# Altium schematic sheet RFID PIC.SchDoc
size A; SheetNumber: 1; SheetTotal: 1
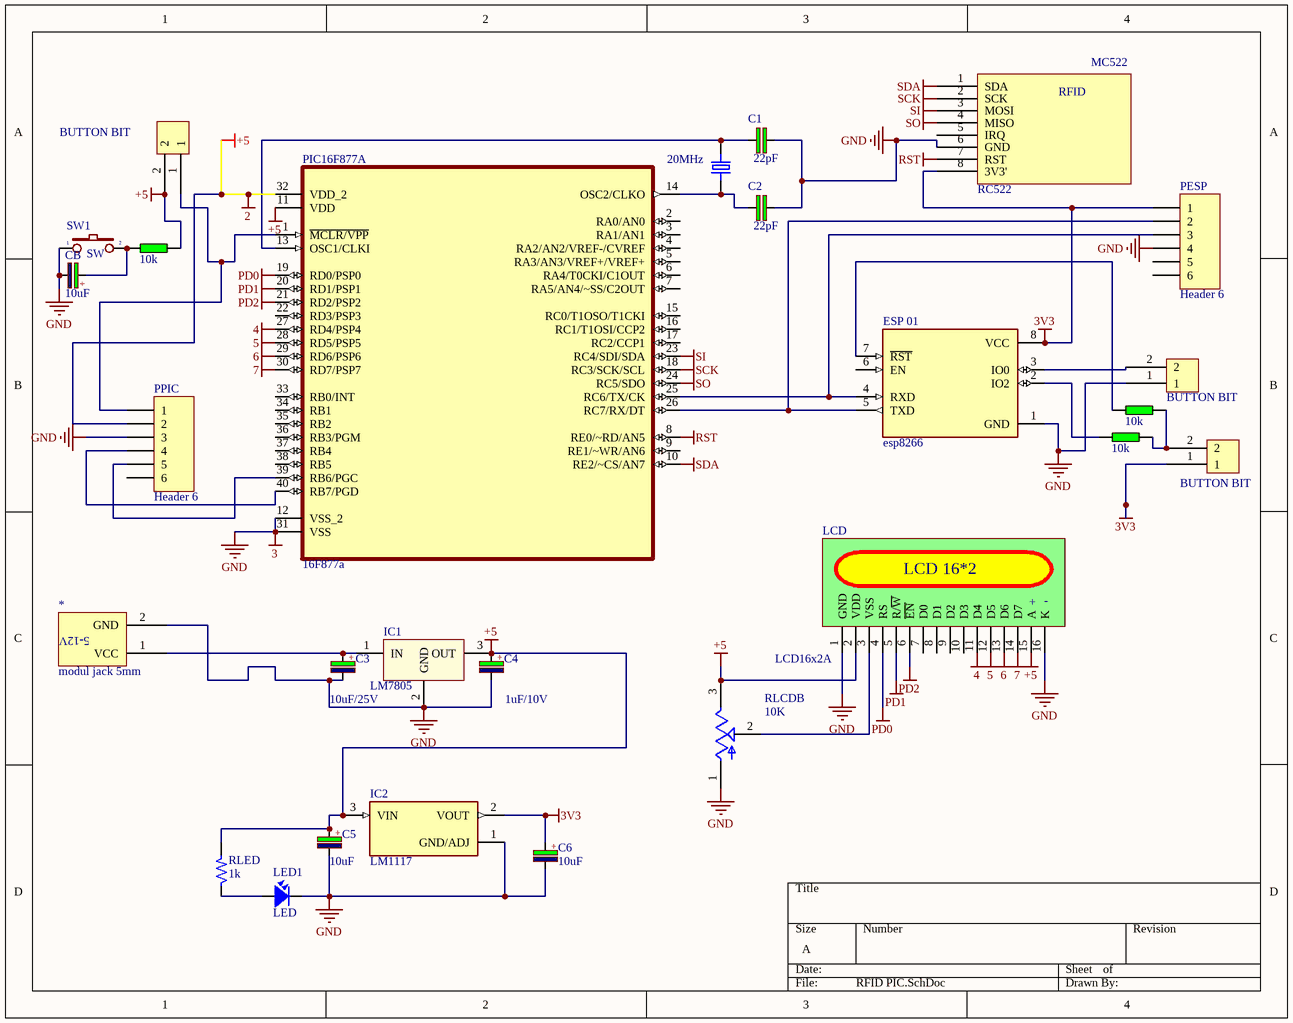
[diagram p0: RFID PIC.SchDoc]

## Parts
1  10k  [R1/8W]
2  10k  [R1/8W]
20MHz  quartz  [XTAL_ECS200S4X]  (value not drawn)
*  modul jack 5mm  [ModulDC]
?  BUTTON BIT  [PCBComponent_1]
B  BUTTON BIT  [PCBComponent_1]
B?  BUTTON BIT  [PCBComponent_1]
C1  22pF  [CN1]
C2  22pF  [CN1]
C3  10uF/25V  [CP1.5/3.4]
C4  1uF/10V  [CP1.5/3.4]
C5  10uF  [CP1/2]
C6  10uF  [CP1/2]
CB  10uF  [CP1/2]
ESP_01  esp8266  [XCVR_ESP8266-01/ESP-01]
IC1  LM7805  [QTO-220]
IC2  LM1117  [TO254P1054X470X1955-3]
LCD  LCD16x2A  [LCD16X2]
LED1  LED  [LED-3]
PESP  Header 6  [HDR1X6]
PIC16F877A  16F877a  [DIP254P1524X483-40]
PPIC  Header 6  [HDR1X6]
RB  10k  [R1/8W]
RFID  RC522  [PCBComponent_1]
RLCD  10K  [TRIM_3362P-1-203]  (part B of 2)
RLED  1k  [R1/4W]
SW1  SW  [SW2]

## Nets
3: *.2(GND) B.1 C1.2 C2.2 C3.2 C4.2 C5.2 C6.2 CB.2 ESP_01.1(GND) IC1.2(GND) IC2.1(GND/ADJ) LCD.1(GND) LCD.16(K) LED1.2 PESP.4 PIC16F877A.12(VSS_2) PIC16F877A.31(VSS) PPIC.3 RFID.6(GND) RLCD.1(CCW) SW1.1  [also labelled GND]
3V3: ?.1 C6.1 ESP_01.8(VCC) IC2.2(VOUT) PESP.1 RFID.8(3V3')
4: LCD.11(D4) PIC16F877A.27(RD4/PSP4)
5: LCD.12(D5) PIC16F877A.28(RD5/PSP5)
6: LCD.13(D6) PIC16F877A.29(RD6/PSP6)
7: LCD.14(D7) PIC16F877A.30(RD7/PSP7)
+5: B?.2 C4.1 C5.1 IC1.3(OUT) IC2.3(VIN) LCD.2(VDD) LCD.15(A) PIC16F877A.11(VDD) PIC16F877A.32(VDD_2) PPIC.2 RB.2 RLCD.3(CW) RLED.2  [also labelled 2]
PD0: LCD.4(RS) PIC16F877A.19(RD0/PSP0)
PD1: LCD.5(R/~{W}) PIC16F877A.20(RD1/PSP1)
PD2: LCD.6(~{EN}) PIC16F877A.21(RD2/PSP2)
RST: PIC16F877A.8(RE0/~RD/AN5) RFID.7(RST)
SCK: PIC16F877A.18(RC3/SCK/SCL) RFID.2(SCK)
SDA: PIC16F877A.10(RE2/~CS/AN7) RFID.1(SDA)
SI: PIC16F877A.23(RC4/SDI/SDA) RFID.3(MOSI)
SO: PIC16F877A.24(RC5/SDO) RFID.4(MISO)
Net1_1: 1.1 2.1 ?.2
Net1_2: 1.2 ESP_01.2(IO2)
Net2_2: 2.2 ESP_01.7(~{RST})
Net20MHz_1: 20MHz.1 C2.1 PIC16F877A.14(OSC2/CLKO)
Net20MHz_2: 20MHz.2 C1.1 PIC16F877A.13(OSC1/CLKI)
Net*_1: *.1(VCC) C3.1 IC1.1(IN)
NetB?_1: B?.1 PIC16F877A.1(~{MCLR/VPP}) PPIC.1
NetB_2: B.2 ESP_01.3(IO0)
NetCB_1: CB.1 RB.1 SW1.2
NetESP_01_4: ESP_01.4(RXD) PESP.3 PIC16F877A.25(RC6/TX/CK)
NetESP_01_5: ESP_01.5(TXD) PESP.2 PIC16F877A.26(RC7/RX/DT)
NetLCD_3: LCD.3(VSS) RLCD.2(WIPER)
NetLED1_1: LED1.1 RLED.1
NetPIC16F877A_39: PIC16F877A.39(RB6/PGC) PPIC.5
NetPIC16F877A_40: PIC16F877A.40(RB7/PGD) PPIC.4

Not connected (* = marked no-connect by the designer): ESP_01 6(EN); LCD 7(D0) 8(D1) 9(D2) 10(D3); PESP 5 6; PIC16F877A 2(RA0/AN0) 3(RA1/AN1) 4(RA2/AN2/VREF-/CVREF) 5(RA3/AN3/VREF+/VREF+) 6(RA4/T0CKI/C1OUT) 7(RA5/AN4/~SS/C2OUT) 9(RE1/~WR/AN6) 15(RC0/T1OSO/T1CKI) 16(RC1/T1OSI/CCP2) 17(RC2/CCP1) 22(RD3/PSP3) 33(RB0/INT) 34(RB1) 35(RB2) 36(RB3/PGM) 37(RB4) 38(RB5); PPIC 6; RFID 5(IRQ)

## Notes on the sheet
- (in symbol CP0) +
- (in symbol CP3) +
- (in symbol LCD16x2) LCD 16*2; -; +
- (in symbol modul jack 5mm) 5-12V
- (in symbol RC522) MC522

## Library data of the parts
1 2 RB RLCD = RES: Resistor 1/4W; Value: R1/4W - 1K
? B B? = DIP
C1 C2 = CAP: Cap np  1pF - 472pF; Value: 100pF
C3 C4 = CP3: Cap 100uF/35V - 470uF/16V; Value: 100uF/35V/50V; Description 1: 1000uF/6,3V - 470uF/16V - 330uF - 25V; Description 2: 220uF/35V - 100uF/50V - 63V - 4,7uF/200V; Description 3: 22uF => 33uF100V - 3,3uF => 4,7uF/250V; Description 4: 2,2uF =>3,3uF/350 - 2,2uF/400V - 1uF/450V
C5 C6 CB = CP0: Cap P  0,1uF < 22uF , 16 - 50V; Value: 10uF/50V; Description 1: 10 => 220uF/6,3V/10V - 10uF => 100uF/16V; Description 2: 0,1uF => 33uF/50V - 10uF => 22uF/63V; Description 3: 0,47uF => 10uF/100V
IC1 = LM78xx: On ap +, from + 5 to + 24VDC; Value: LM7805
IC2 = asm1117
LCD = LCD16x2: LCD dipslay 16 char, 2 line; Value: LCD16x2A
LED1 = LED: LED Single colour Green and Red; Value: LED 3 ly Single Colour
PESP PPIC = Header 6: Header, 6-Pin; LatestRevisionDate: 17-Jul-2002; LatestRevisionNote: Re-released for DXP Platform.; Publisher: Altium Limited
RLED = R: Resistor 1/4W; Value: R1/4W - 1K
SW1 = SW2: Switch button 2 pin; Value: SW chip 2 pin